# Altium schematic sheet BLOCK_DIAGRAM.SchDoc
size 297 x 209 mm; Engineer: Aleksandr Sereda; Revision: 01_1; SheetNumber: 2; SheetTotal: 11; Email: avsjob000@gmail.com
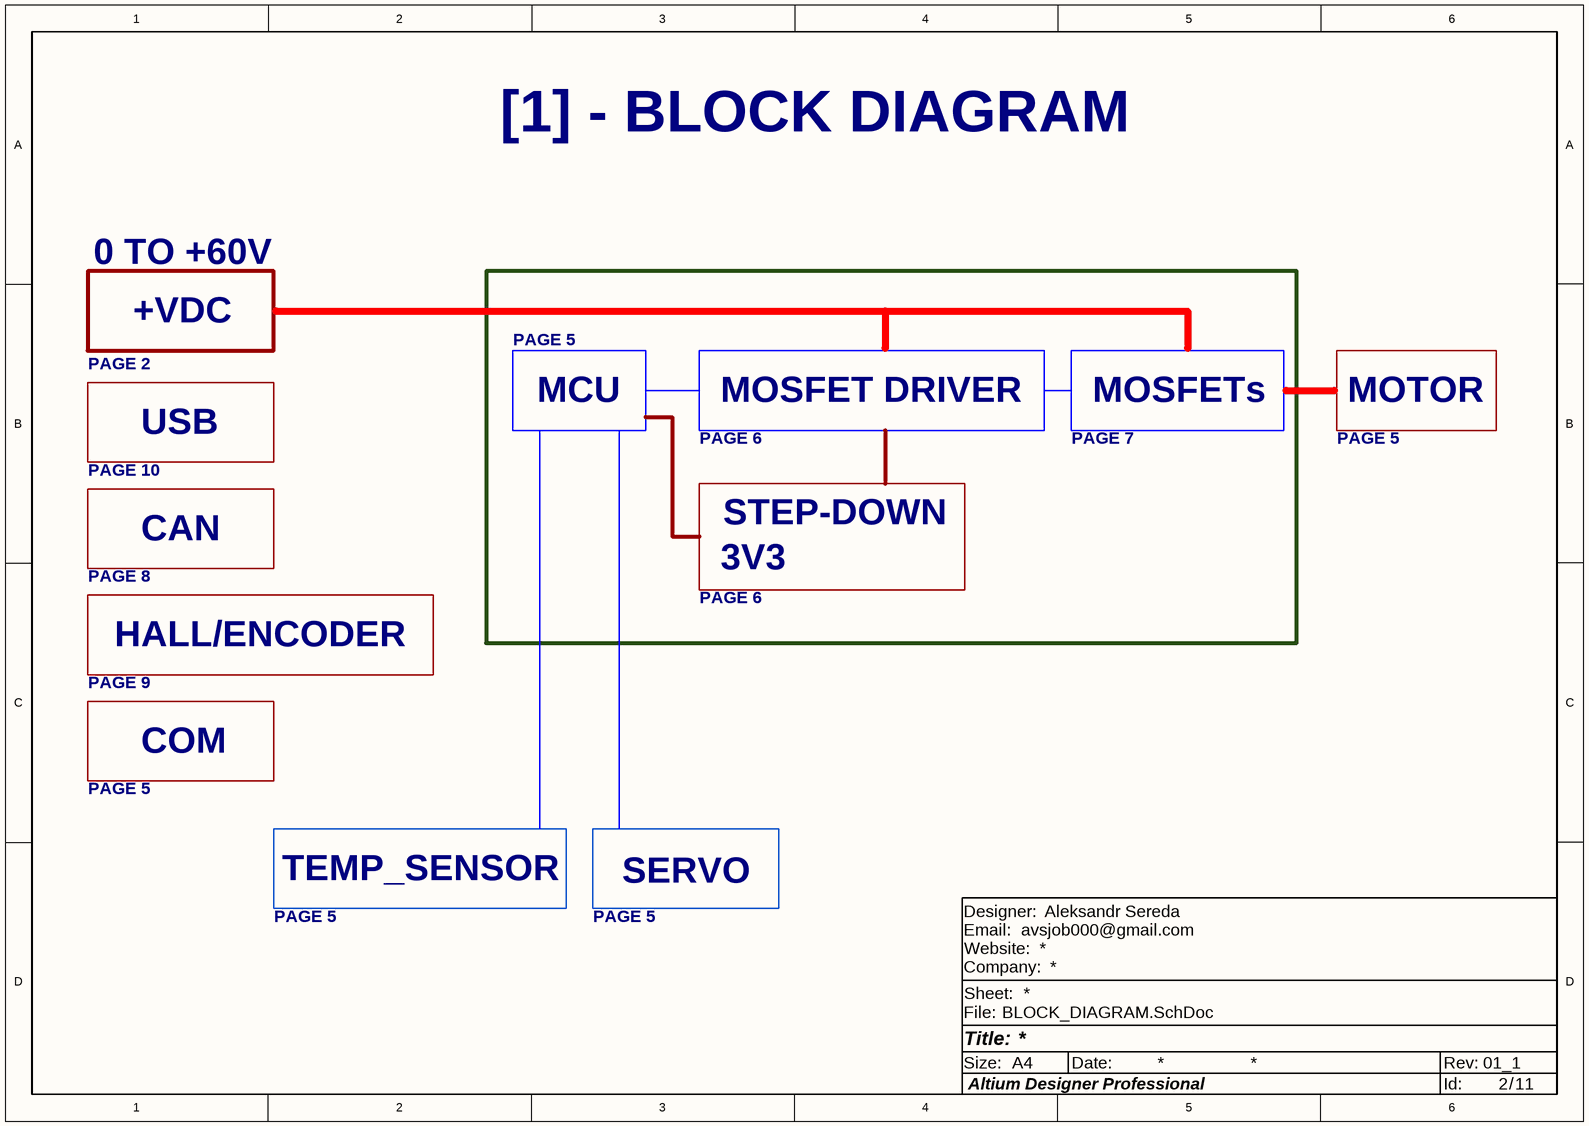
[diagram p0: BLOCK_DIAGRAM.SchDoc]

## Notes on the sheet
- [1] - BLOCK DIAGRAM
- 0 TO +60V
- +VDC
- PAGE 2
- PAGE 5
- MCU
- MOSFET DRIVER
- MOSFETs
- MOTOR
- USB
- PAGE 6
- PAGE 7
- PAGE 10
- STEP-DOWN
- PAGE 8
- CAN
- 3V3
- HALL/ENCODER
- PAGE 9
- COM
- TEMP_SENSOR
- SERVO
- Email:
- Website:
- Designer:
- File:
- Sheet:
- Company:
- Size:
- Title:
- A4
- Altium Designer Professional
- Date:
- Id:
- Rev:
- /